# EAGLE design p2c-100 (EAGLE 9.1.0)
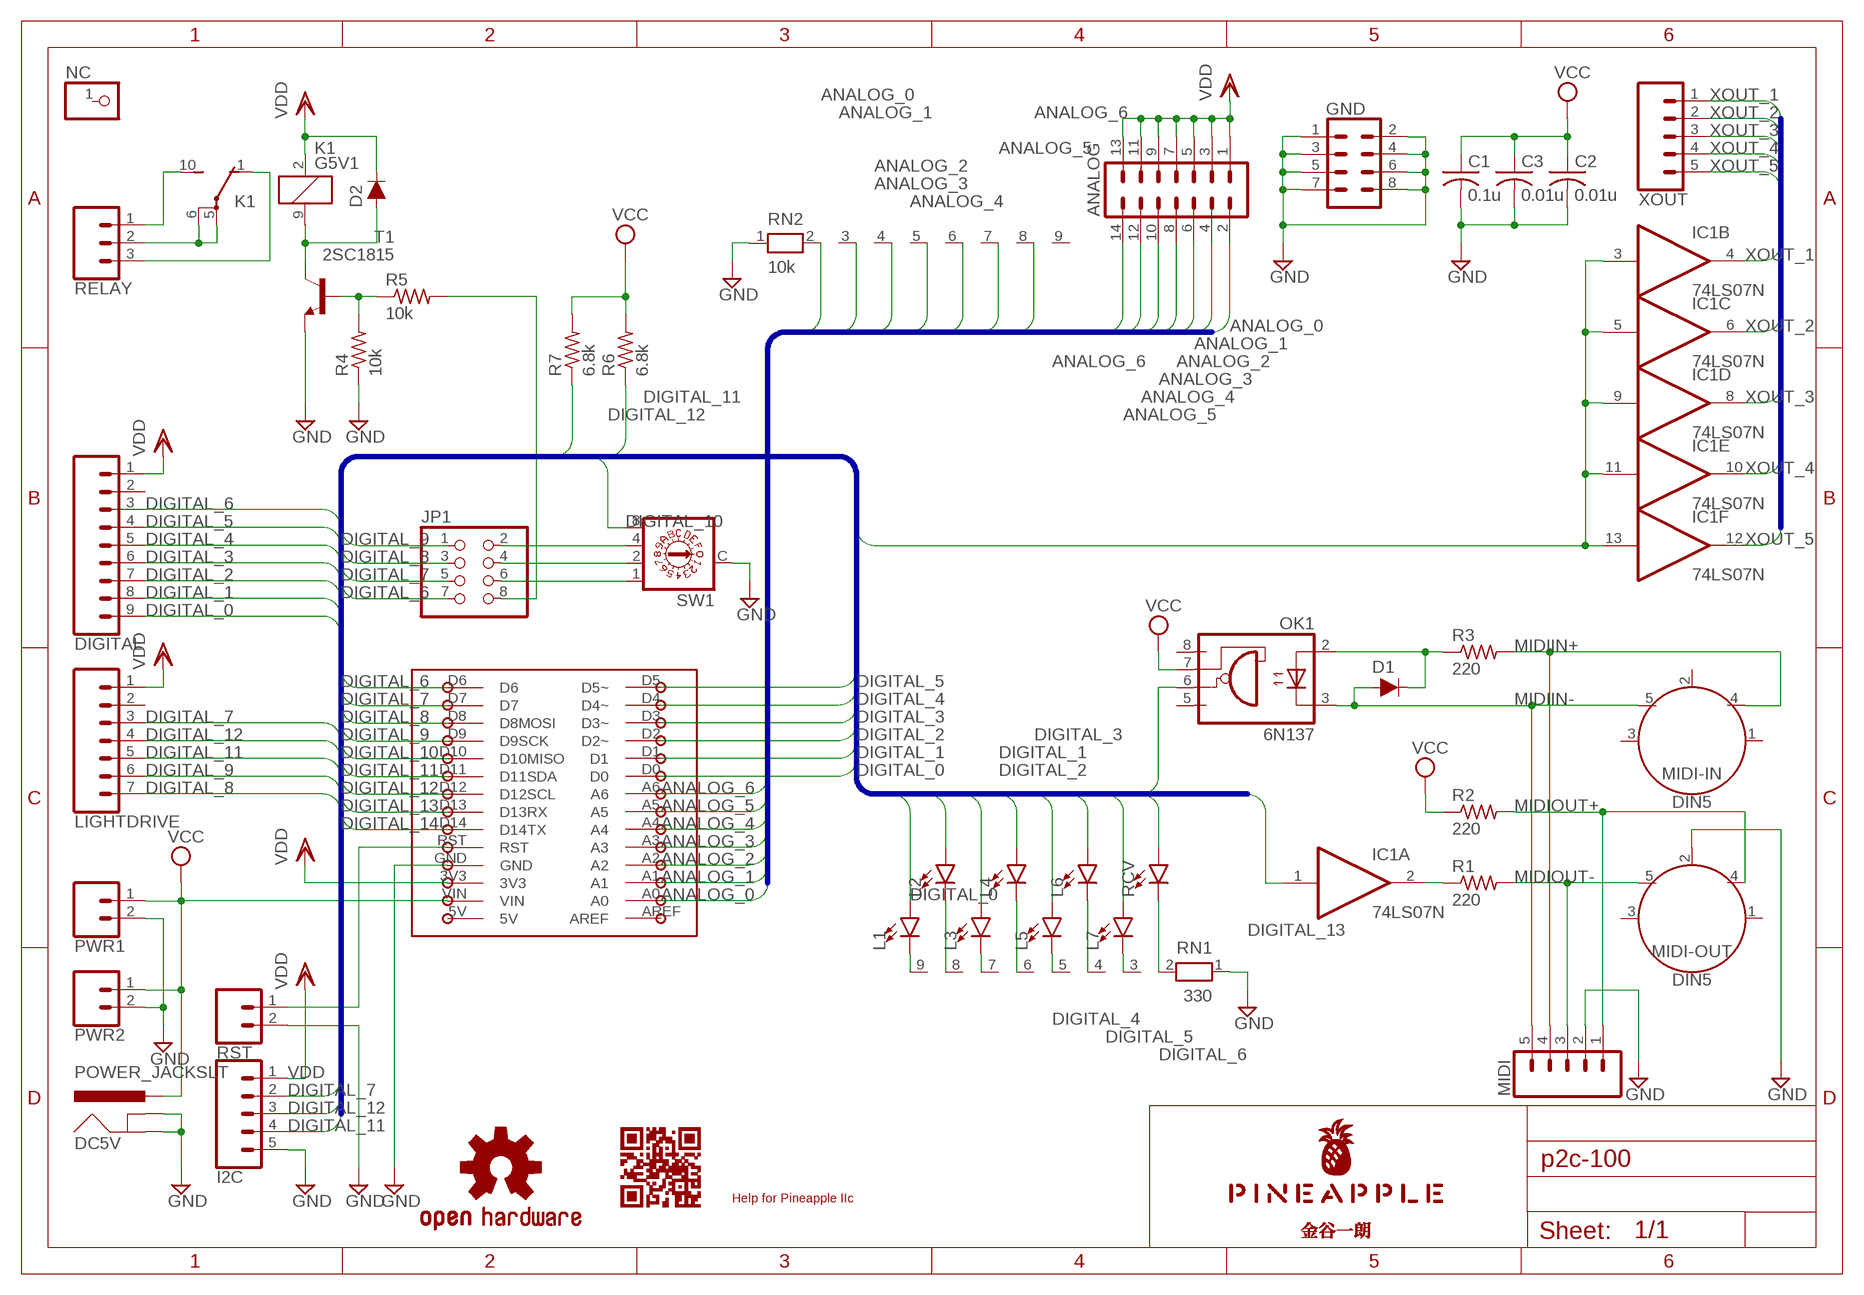
[diagram p0: schematic, sheet 1]

## Parts
ANALOG  ML14L  [ML14L]
C1  0.1u  C-US025-025X050  [C025-025X050]
C2  0.01u  C-US025-024X044  [C025-024X044]
C3  0.01u  C-US025-024X044  [C025-024X044]
D1  DIODE-1N4148  [DIODE-1N4148]
D2  DIODE-1N4148  [DIODE-1N4148]
DC5V  POWER_JACKSLT  [POWER_JACK_SLOT]
DIGITAL  CONN_09  [1X09]
GND  CONN_04X2  [2X4]
I2C  CONN_05SMD2  [1X05_1MM_RA]
IC1  74LS07N  [DIL14]
JP1  PINHD-2X4  [2X04]
K1  G5V1  [G5V1]
L1  LED-3MM-NO_SILK  [LED_3MM-NS]
L2  LED-3MM-NO_SILK  [LED_3MM-NS]
L3  LED-3MM-NO_SILK  [LED_3MM-NS]
L4  LED-3MM-NO_SILK  [LED_3MM-NS]
L5  LED-3MM-NO_SILK  [LED_3MM-NS]
L6  LED-3MM-NO_SILK  [LED_3MM-NS]
L7  LED-3MM-NO_SILK  [LED_3MM-NS]
LIGHTDRIVE  CONN_07  [1X07]
LOGO1  OSHW-LOGOS-COPPER  [OSHW-LOGO-S_COPPER]
MIDI  CONN_05JST  [JST-5-PTH]
MIDI-IN  DIN5  [DIN5-RA-PTH]
MIDI-OUT  DIN5  [DIN5-RA-PTH]
NC  PINHD-1X1  [1X01]
OK1  6N137  [DIL08]
PWR1  CONN_02  [1X02]
PWR2  CONN_02JST-PTH-2  [JST-2-PTH]
R1  220  R-US_0204/5  [0204/5]
R2  220  R-US_0204/5  [0204/5]
R3  220  R-US_0204/5  [0204/5]
R4  10k  R-US_0204/5  [0204/5]
R5  10k  R-US_0204/5  [0204/5]
R6  6.8k  R-US_0204/5  [0204/5]
R7  6.8k  R-US_0204/5  [0204/5]
RCV  LED-3MM-NO_SILK  [LED_3MM-NS]
RELAY  CONN_03JST-PTH  [JST-3-PTH]
RN1  330  RN08  [RN-9]
RN2  10k  RN08  [RN-9]
RST  CONN_02JST-PTH-2  [JST-2-PTH]
SW1  A1353HEX  [A1353HEX]
T1  2SC1815  [TO92-ECB]
U1  MKR1000  [MKR1000]
U$1  PINEAPPLE450_SILK  [PINEAPPLE450_SILK]
U$3  KANAYA768_SILK  [KANAYA768_SILK]
U$4  CARDQRCODE450_SILK  [CARDQRCODE450_SILK]
U$5  HELP_P2C  [HELP_P2C]
XOUT  CONN_05  [1X05]

## Nets
ANALOG_0: ANALOG.2 RN2.2 U1.A0
ANALOG_1: ANALOG.4 RN2.3 U1.A1
ANALOG_2: ANALOG.6 RN2.4 U1.A2
ANALOG_3: ANALOG.8 RN2.5 U1.A3
ANALOG_4: ANALOG.10 RN2.6 U1.A4
ANALOG_5: ANALOG.12 RN2.7 U1.A5
ANALOG_6: ANALOG.14 RN2.8 U1.A6
DIGITAL_0: DIGITAL.9 L1.A U1.D0
DIGITAL_1: DIGITAL.8 L2.A U1.D1
DIGITAL_2: DIGITAL.7 L3.A U1.D2(D2~)
DIGITAL_3: DIGITAL.6 L4.A U1.D3(D3~)
DIGITAL_4: DIGITAL.5 L5.A U1.D4(D4~)
DIGITAL_5: DIGITAL.4 L6.A U1.D5(D5~)
DIGITAL_6: DIGITAL.3 JP1.7 L7.A U1.D6
DIGITAL_7: I2C.2 JP1.5 LIGHTDRIVE.3 U1.D7
DIGITAL_8: JP1.3 LIGHTDRIVE.7 U1.D8(D8MOSI)
DIGITAL_9: JP1.1 LIGHTDRIVE.6 U1.D9(D9SCK)
DIGITAL_10: SW1.8 U1.D10(D10MISO)
DIGITAL_11: I2C.4 LIGHTDRIVE.5 R6.1 U1.D11(D11SDA)
DIGITAL_12: I2C.3 LIGHTDRIVE.4 R7.1 U1.D12(D12SCL)
DIGITAL_13: OK1.6(VO) RCV.A U1.D13(D13RX)
DIGITAL_14: IC1.1(A:I) IC1.3(B:I) IC1.5(C:I) IC1.9(D:I) IC1.11(E:I) IC1.13(F:I) U1.D14(D14TX)
GND [ground]: C1.2 C2.2 C3.2 DC5V.GND@1(GNDBREAK) DC5V.GND@2(GND) GND.1 GND.2 GND.3 GND.4 GND.5 GND.6 GND.7 GND.8 I2C.5 MIDI-OUT.2 MIDI.2 PWR1.2 PWR2.2 R4.1 RN1.1 RN2.1 RST.2 SW1.C T1.E U1.GND
MIDIIN+: MIDI-IN.4 MIDI.4 R3.2
MIDIIN-: D1.A MIDI-IN.5 MIDI.5 OK1.3(C)
MIDIINA: D1.C OK1.2(A) R3.1
MIDIOUT+: MIDI-OUT.4 MIDI.1 R2.2
MIDIOUT-: MIDI-OUT.5 MIDI.3 R1.2
MIDIOUTC: IC1.2(A:O) R1.1
N$1: L1.K(C) RN1.9
N$2: RST.1 U1.RST
N$3: JP1.8 R5.2
N$4: JP1.6 SW1.1
N$5: JP1.4 SW1.2
N$6: JP1.2 SW1.4
N$7: L2.K(C) RN1.8
N$8: L3.K(C) RN1.7
N$9: L4.K(C) RN1.6
N$10: L5.K(C) RN1.5
N$11: L6.K(C) RN1.4
N$12: L7.K(C) RN1.3
N$13: RCV.K(C) RN1.2
RELAYCOM: K1.5(2:P) K1.6(2:P) RELAY.2
RELAYDRIVE: R4.2 R5.1 T1.B
RELAYNC: K1.1(2:O) RELAY.3
RELAYNO: K1.10(2:S) RELAY.1
RELAYTR: D2.A K1.9 T1.C
VCC [power2]: C1.1 C2.1 C3.1 DC5V.PWR OK1.7(VE) PWR1.1 PWR2.1 R2.1 R6.2 R7.2 U1.VIN
VDD [power1]: ANALOG.1 ANALOG.3 ANALOG.5 ANALOG.7 ANALOG.9 ANALOG.11 ANALOG.13 D2.C DIGITAL.1 I2C.1 K1.2 LIGHTDRIVE.1 U1.3V3
XOUT_1: IC1.4(B:O) XOUT.1
XOUT_2: IC1.6(C:O) XOUT.2
XOUT_3: IC1.8(D:O) XOUT.3
XOUT_4: IC1.10(E:O) XOUT.4
XOUT_5: IC1.12(F:O) XOUT.5
Unconnected: DIGITAL.2 LIGHTDRIVE.2 MIDI-IN.1 MIDI-IN.2 MIDI-IN.3 MIDI-OUT.1 MIDI-OUT.3 NC.1 OK1.5(GND) OK1.8(VCC) RN2.9 U1.5V U1.AREF

## Buses
XOUT:XOUT_1,XOUT_2,XOUT_3,XOUT_4,XOUT_5
DIGITAL:DIGITAL_0,DIGITAL_1,DIGITAL_2,DIGITAL_3,DIGITAL_4,DIGITAL_5,DIGITAL_6,DIGITAL_7,DIGITAL_8,DIGITAL_9,DIGITAL_10,DIGITAL_11,DIGITAL_12,DIGITAL_13,DIGITAL_14
ANALOG:ANALOG_0,ANALOG_1,ANALOG_2,ANALOG_3,ANALOG_4,ANALOG_5,ANALOG_6

## Power pins joined to a net without a drawn wire
GND: IC1.7(P:GND)
VCC: IC1.14(P:VCC)

## Library data of the parts
ANALOG = con-ml:ML14L: HARTING; OC_FARNELL: unknown; OC_NEWARK: unknown
C1-C3 = resistor:C-US: CAPACITOR, American symbol
D1 D2 = SparkFun-DiscreteSemi:DIODE: Diode These are standard reverse protection diodes and small signal diodes. SparkFun Products: SparkFun SparkPunk Sound Kit <https://www.sparkfun.com/products/11177> SparkFun ESP8266 Thing <https://www.sparkfun.com/products/13231>; PROD_ID: DIO-08378; VALUE: 200mA/100V/1V
DC5V = SparkFun-Connectors:POWER_JACK: Power Jack Connector This is the standard 5.5mm barrel jack for power. The PTH is the most common, proven, reliable, footprint. The Slot footprint only works if the mill layer is transmitted to the PCB fab house so be warned. Here are the connectors we sell at SparkFun: DC Barrel Power Jack/Connector <https://www.sparkfun.com/products/119> (PRT-00119) DC Barrel Power Jack/Connector (SMD) <https://www.sparkfun.com/products/12748> (PRT-12748) DC Barrel Jack Adapter - Breadboard Compatible <https://www.sparkfun.com/products/10811> (PRT-10811) It is used on this SparkFun product (and many, many others): SparkFun RedBoard - Programmed with Arduino <https://www.sparkfun.com/products/12757> (DEV-12757) Also, if you need a mating power supply or connector, please check these out: Wall Adapter Power Supply - 9VDC 650mA <https://www.sparkfun.com/products/298> (TOL-00298) DC Barrel Jack Adapter - Male <https://www.sparkfun.com/products/10287> (PRT-10287); PROD_ID: PRT-00119
DIGITAL = SparkFun-Connectors:CONN_09: Multi connection point. Often used as Generic Header-pin footprint for 0.1 inch spaced/style header connections On any of the 0.1 inch spaced packages, you can populate with these: Break Away Headers - Straight <https://www.sparkfun.com/products/116> (PRT-00116) Break Away Male Headers - Right Angle <https://www.sparkfun.com/products/553> (PRT-00553) Female Headers <https://www.sparkfun.com/products/115> (PRT-00115) Break Away Headers - Machine Pin <https://www.sparkfun.com/products/117> (PRT-00117) Break Away Female Headers - Swiss Machine Pin <https://www.sparkfun.com/products/743> (PRT-00743) For SCREWTERMINALS and SPRING TERMINALS visit here: Screw Terimnals on SparkFun.com <https://www.sparkfun.com/search/results?term=Screw+Terminals> (5mm/3.5mm/2.54mm spacing) This device is also useful as a general connection point to wire up your design to another part of your project. Our various solder wires solder well into these plated through hole pads. Hook-Up Wire - Assortment (Stranded, 22 AWG) <https://www.sparkfun.com/products/11375> (PRT-11375) Hook-Up Wire - Assortment (Solid Core, 22 AWG) <https://www.sparkfun.com/products/11367> (PRT-11367) View the entire wire category on our website here <https://www.sparkfun.com/categories/141> Special notes: Molex polarized connector foot print use with SKU : PRT-08231 with associated crimp pins and housings. 1MM SMD Version SKU: PRT-10208 NOTES ON THE VARIANTS LOCK and LOCK_LONGPADS... This footprint was designed to help hold the alignment of a through-hole component (i.e. 6-pin header) while soldering it into place. You may notice that each hole has been shifted either up or down by 0.005 of an inch from it's more standard position (which is a perfectly straight line). This slight alteration caused the pins (the squares in the middle) to touch the edges of the holes. Because they are alternating, it causes a "brace" to hold the component in place. 0.005 has proven to be the perfect amount of "off-center" position when using our standard breakaway headers. Although looks a little odd when you look at the bare footprint, once you have a header in there, the alteration is very hard to notice. Also,if you push a header all the way into place, it is covered up entirely on the bottom side.
GND = SparkFun-Connectors:CONN_04X2: Multi connection point. Often used as Generic Header-pin footprint for 0.1 inch spaced/style header connections On any of the 0.1 inch spaced packages, you can populate with these: Break Away Headers - Straight <https://www.sparkfun.com/products/116> (PRT-00116) Break Away Male Headers - Right Angle <https://www.sparkfun.com/products/553> (PRT-00553) Female Headers <https://www.sparkfun.com/products/115> (PRT-00115) Break Away Headers - Machine Pin <https://www.sparkfun.com/products/117> (PRT-00117) Break Away Female Headers - Swiss Machine Pin <https://www.sparkfun.com/products/743> (PRT-00743)
I2C XOUT = SparkFun-Connectors:CONN_05: Multi connection point. Often used as Generic Header-pin footprint for 0.1 inch spaced/style header connections On any of the 0.1 inch spaced packages, you can populate with these: Break Away Headers - Straight <https://www.sparkfun.com/products/116> (PRT-00116) Break Away Male Headers - Right Angle <https://www.sparkfun.com/products/553> (PRT-00553) Female Headers <https://www.sparkfun.com/products/115> (PRT-00115) Break Away Headers - Machine Pin <https://www.sparkfun.com/products/117> (PRT-00117) Break Away Female Headers - Swiss Machine Pin <https://www.sparkfun.com/products/743> (PRT-00743) For SCREWTERMINALS and SPRING TERMINALS visit here: Screw Terimnals on SparkFun.com <https://www.sparkfun.com/search/results?term=Screw+Terminals> (5mm/3.5mm/2.54mm spacing) This device is also useful as a general connection point to wire up your design to another part of your project. Our various solder wires solder well into these plated through hole pads. Hook-Up Wire - Assortment (Stranded, 22 AWG) <https://www.sparkfun.com/products/11375> (PRT-11375) Hook-Up Wire - Assortment (Solid Core, 22 AWG) <https://www.sparkfun.com/products/11367> (PRT-11367) View the entire wire category on our website here <https://www.sparkfun.com/categories/141> Special notes: Molex polarized connector foot print use with SKU : PRT-08231 with associated crimp pins and housings. 1MM SMD Version SKU: PRT-10208
IC1 = 74xx-us:74*07: Hex BUFFER, open collector high-voltage output
JP1 = pinhead:PINHD-2X4: PIN HEADER
K1 = relay:G5V1: RELAY 1 x switch, 0.5 A/125 V AC, 1 A/24 V DC , Omron; MPN: G5V-1-DC24; OC_FARNELL: 9949593; OC_NEWARK: 36M6377
L1-L7 RCV = SparkFun-LED:LED: LED (Generic) Standard schematic elements and footprints for 5mm, 3mm, 1206, and 0603 sized LEDs. Generic LEDs with no color specified.
LIGHTDRIVE = SparkFun-Connectors:CONN_07: Multi connection point. Often used as Generic Header-pin footprint for 0.1 inch spaced/style header connections On any of the 0.1 inch spaced packages, you can populate with these: Break Away Headers - Straight <https://www.sparkfun.com/products/116> (PRT-00116) Break Away Male Headers - Right Angle <https://www.sparkfun.com/products/553> (PRT-00553) Female Headers <https://www.sparkfun.com/products/115> (PRT-00115) Break Away Headers - Machine Pin <https://www.sparkfun.com/products/117> (PRT-00117) Break Away Female Headers - Swiss Machine Pin <https://www.sparkfun.com/products/743> (PRT-00743) For SCREWTERMINALS and SPRING TERMINALS visit here: Screw Terimnals on SparkFun.com <https://www.sparkfun.com/search/results?term=Screw+Terminals> (5mm/3.5mm/2.54mm spacing) This device is also useful as a general connection point to wire up your design to another part of your project. Our various solder wires solder well into these plated through hole pads. Hook-Up Wire - Assortment (Stranded, 22 AWG) <https://www.sparkfun.com/products/11375> (PRT-11375) Hook-Up Wire - Assortment (Solid Core, 22 AWG) <https://www.sparkfun.com/products/11367> (PRT-11367) View the entire wire category on our website here <https://www.sparkfun.com/categories/141> Special notes: Molex polarized connector foot print use with SKU : PRT-08231 with associated crimp pins and housings. 1MM SMD Version SKU: PRT-10208 NOTES ON THE VARIANTS LOCK and LOCK_LONGPADS... This footprint was designed to help hold the alignment of a through-hole component (i.e. 6-pin header) while soldering it into place. You may notice that each hole has been shifted either up or down by 0.005 of an inch from it's more standard position (which is a perfectly straight line). This slight alteration caused the pins (the squares in the middle) to touch the edges of the holes. Because they are alternating, it causes a "brace" to hold the component in place. 0.005 has proven to be the perfect amount of "off-center" position when using our standard breakaway headers. Although looks a little odd when you look at the bare footprint, once you have a header in there, the alteration is very hard to notice. Also,if you push a header all the way into place, it is covered up entirely on the bottom side.
LOGO1 = SparkFun-Aesthetics:OSHW-LOGO: Open-Source Hardware (OSHW) Logo This logo indicates the piece of hardware it is found on incorporates a OSHW license and/or adheres to the definition of open source hardware found here: http://freedomdefined.org/OSHW
MIDI = SparkFun-Connectors:CONN_05: Multi connection point. Often used as Generic Header-pin footprint for 0.1 inch spaced/style header connections On any of the 0.1 inch spaced packages, you can populate with these: Break Away Headers - Straight <https://www.sparkfun.com/products/116> (PRT-00116) Break Away Male Headers - Right Angle <https://www.sparkfun.com/products/553> (PRT-00553) Female Headers <https://www.sparkfun.com/products/115> (PRT-00115) Break Away Headers - Machine Pin <https://www.sparkfun.com/products/117> (PRT-00117) Break Away Female Headers - Swiss Machine Pin <https://www.sparkfun.com/products/743> (PRT-00743) For SCREWTERMINALS and SPRING TERMINALS visit here: Screw Terimnals on SparkFun.com <https://www.sparkfun.com/search/results?term=Screw+Terminals> (5mm/3.5mm/2.54mm spacing) This device is also useful as a general connection point to wire up your design to another part of your project. Our various solder wires solder well into these plated through hole pads. Hook-Up Wire - Assortment (Stranded, 22 AWG) <https://www.sparkfun.com/products/11375> (PRT-11375) Hook-Up Wire - Assortment (Solid Core, 22 AWG) <https://www.sparkfun.com/products/11367> (PRT-11367) View the entire wire category on our website here <https://www.sparkfun.com/categories/141> Special notes: Molex polarized connector foot print use with SKU : PRT-08231 with associated crimp pins and housings. 1MM SMD Version SKU: PRT-10208; SF_ID: PRT-09917
MIDI-IN MIDI-OUT = SparkFun-Connectors:DIN5: DIN5 Connector - Female Right Angle (frequently used as a MIDI Jack connector) This type of connector and cable is frequently used for transmitting midi data (musical instrument digital interface). It is what you usually see on a keyboard or set of electronic drums. Learn more here <https://en.wikipedia.org/wiki/MIDI>. For more information on the pinout and electrical specifications of MIDI communications, please see the following resource: https://www.midi.org/specifications/item/midi-din-electrical-specification Here is the connector we sell at SparkFun: MIDI Connector - Female Right Angle <https://www.sparkfun.com/products/9536> (PRT-09536) Datasheet <hhttp://www.sparkfun.com/datasheets/Prototyping/Connectors/MIDI-RA.pdf> It is used on this SparkFun product: SparkFun MIDI Shield <https://www.sparkfun.com/products/12898> (DEV-12898); PROD_ID: CONN-09481
NC = pinhead:PINHD-1X1: PIN HEADER
OK1 = optocoupler:6N137: MOTOROLA OPTO COUPLER; MPN: 6N137; OC_FARNELL: 1328376; OC_NEWARK: 52M1895
PWR1 = SparkFun-Connectors:CONN_02: Multi connection point. Often used as Generic Header-pin footprint for 0.1 inch spaced/style header connections On any of the 0.1 inch spaced packages, you can populate with these: Break Away Headers - Straight <https://www.sparkfun.com/products/116> (PRT-00116) Break Away Male Headers - Right Angle <https://www.sparkfun.com/products/553> (PRT-00553) Female Headers <https://www.sparkfun.com/products/115> (PRT-00115) Break Away Headers - Machine Pin <https://www.sparkfun.com/products/117> (PRT-00117) Break Away Female Headers - Swiss Machine Pin <https://www.sparkfun.com/products/743> (PRT-00743) For SCREWTERMINALS and SPRING TERMINALS visit here: Screw Terimnals on SparkFun.com <https://www.sparkfun.com/search/results?term=Screw+Terminals> (5mm/3.5mm/2.54mm spacing) This device is also useful as a general connection point to wire up your design to another part of your project. Our various solder wires solder well into these plated through hole pads. Hook-Up Wire - Assortment (Stranded, 22 AWG) <https://www.sparkfun.com/products/11375> (PRT-11375) Hook-Up Wire - Assortment (Solid Core, 22 AWG) <https://www.sparkfun.com/products/11367> (PRT-11367) View the entire wire category on our website here <https://www.sparkfun.com/categories/141> Special notes: Molex polarized connector foot print use with: PRT-08233 with associated crimp pins and housings. 2.54_SCREWTERM for use with PRT-10571. 3.5mm Screw Terminal footprints for PRT-08084 5mm Screw Terminal footprints for use with PRT-08432
PWR2 RST = SparkFun-Connectors:CONN_02: Multi connection point. Often used as Generic Header-pin footprint for 0.1 inch spaced/style header connections On any of the 0.1 inch spaced packages, you can populate with these: Break Away Headers - Straight <https://www.sparkfun.com/products/116> (PRT-00116) Break Away Male Headers - Right Angle <https://www.sparkfun.com/products/553> (PRT-00553) Female Headers <https://www.sparkfun.com/products/115> (PRT-00115) Break Away Headers - Machine Pin <https://www.sparkfun.com/products/117> (PRT-00117) Break Away Female Headers - Swiss Machine Pin <https://www.sparkfun.com/products/743> (PRT-00743) For SCREWTERMINALS and SPRING TERMINALS visit here: Screw Terimnals on SparkFun.com <https://www.sparkfun.com/search/results?term=Screw+Terminals> (5mm/3.5mm/2.54mm spacing) This device is also useful as a general connection point to wire up your design to another part of your project. Our various solder wires solder well into these plated through hole pads. Hook-Up Wire - Assortment (Stranded, 22 AWG) <https://www.sparkfun.com/products/11375> (PRT-11375) Hook-Up Wire - Assortment (Solid Core, 22 AWG) <https://www.sparkfun.com/products/11367> (PRT-11367) View the entire wire category on our website here <https://www.sparkfun.com/categories/141> Special notes: Molex polarized connector foot print use with: PRT-08233 with associated crimp pins and housings. 2.54_SCREWTERM for use with PRT-10571. 3.5mm Screw Terminal footprints for PRT-08084 5mm Screw Terminal footprints for use with PRT-08432; PROD_ID: CONN-09863; SKU: PRT-09914
R1-R7 = resistor:R-US_: RESISTOR, American symbol
RELAY = SparkFun-Connectors:CONN_03: Multi connection point. Often used as Generic Header-pin footprint for 0.1 inch spaced/style header connections On any of the 0.1 inch spaced packages, you can populate with these: Break Away Headers - Straight <https://www.sparkfun.com/products/116> (PRT-00116) Break Away Male Headers - Right Angle <https://www.sparkfun.com/products/553> (PRT-00553) Female Headers <https://www.sparkfun.com/products/115> (PRT-00115) Break Away Headers - Machine Pin <https://www.sparkfun.com/products/117> (PRT-00117) Break Away Female Headers - Swiss Machine Pin <https://www.sparkfun.com/products/743> (PRT-00743) Stackable Header - 3 Pin (Female, 0.1") <https://www.sparkfun.com/products/13875> (PRT-13875) For SCREWTERMINALS and SPRING TERMINALS visit here: Screw Terimnals on SparkFun.com <https://www.sparkfun.com/search/results?term=Screw+Terminals> (5mm/3.5mm/2.54mm spacing) This device is also useful as a general connection point to wire up your design to another part of your project. Our various solder wires solder well into these plated through hole pads. Hook-Up Wire - Assortment (Stranded, 22 AWG) <https://www.sparkfun.com/products/11375> (PRT-11375) Hook-Up Wire - Assortment (Solid Core, 22 AWG) <https://www.sparkfun.com/products/11367> (PRT-11367) View the entire wire category on our website here <https://www.sparkfun.com/categories/141> Special notes: Molex polarized connector foot print use with SKU : PRT-08232 with associated crimp pins and housings.; PROD_ID: WIRE-10037; SF_ID: PRT-09915
RN1 RN2 = resistor-net:RN08: RESISTOR NETWORK; OC_FARNELL: unknown; OC_NEWARK: unknown
SW1 = switch-dil:A1353HEX: DIL/CODE SWITCH; OC_FARNELL: unknown; OC_NEWARK: unknown
T1 = transistor:2SC1815: NPN EPITAXIAL TRANSISTOR Source: TOSHIBA .. 2SC1815 1.pdf
U1 = mkr1000:MKR1000
U$1 = pineapple:PINEAPPLE450_SILK
U$3 = pineapple:KANAYA768_SILK
U$4 = pineapple:CARDQRCODE450_SILK
U$5 = pineapple:HELP_P2C

## Net classes
0 default: width 0.152 mm, drill 0.305 mm, clearance 0.152 mm
1 ground: width 0.152 mm, drill 0.305 mm, clearance 0.152 mm
2 power1: width 0.305 mm, drill 0.305 mm, clearance 0.152 mm
3 power2: width 0.61 mm, drill 0.305 mm, clearance 0.152 mm

## Board
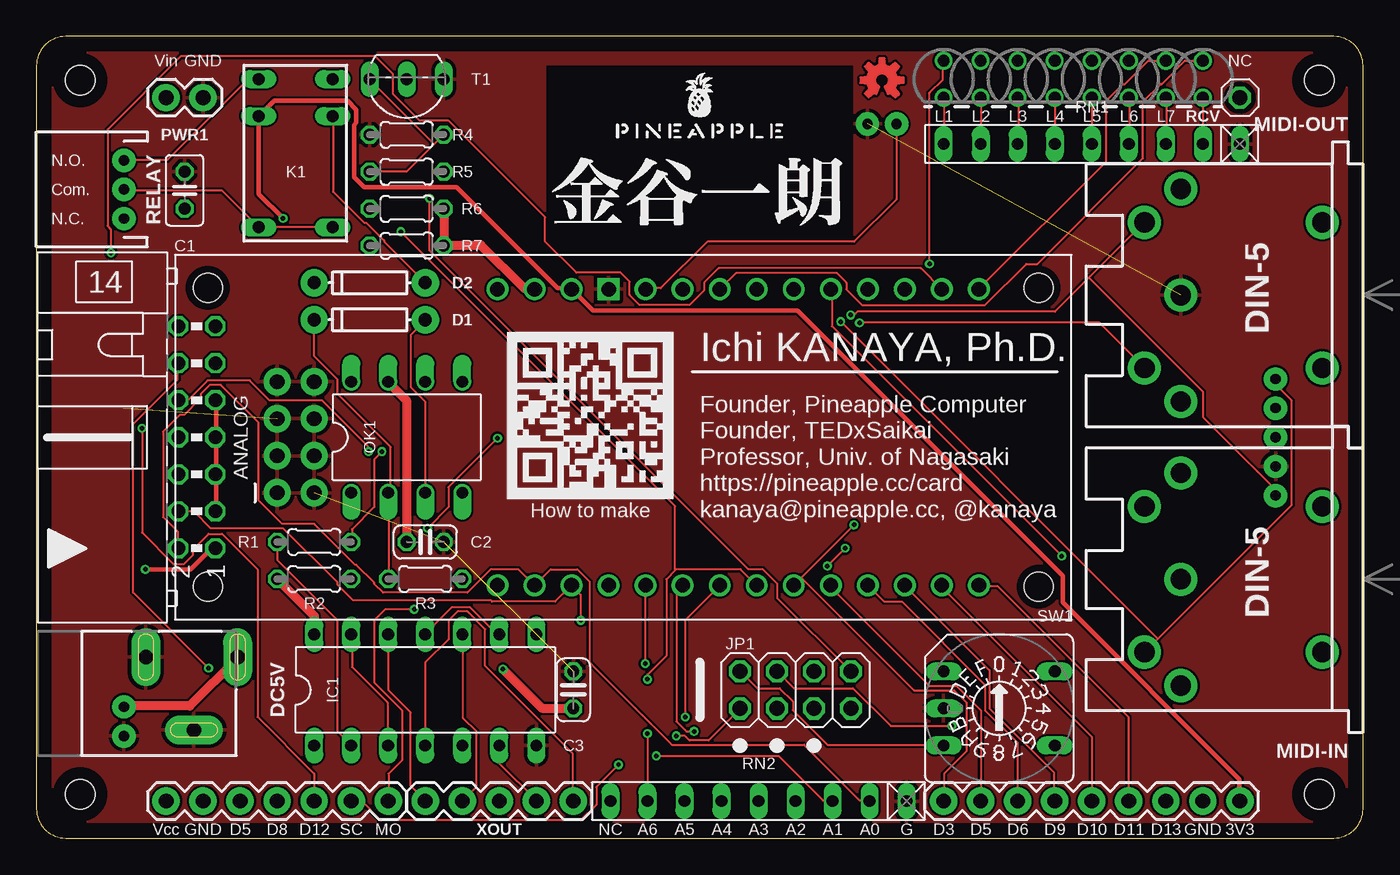
[diagram p1: board, top side]
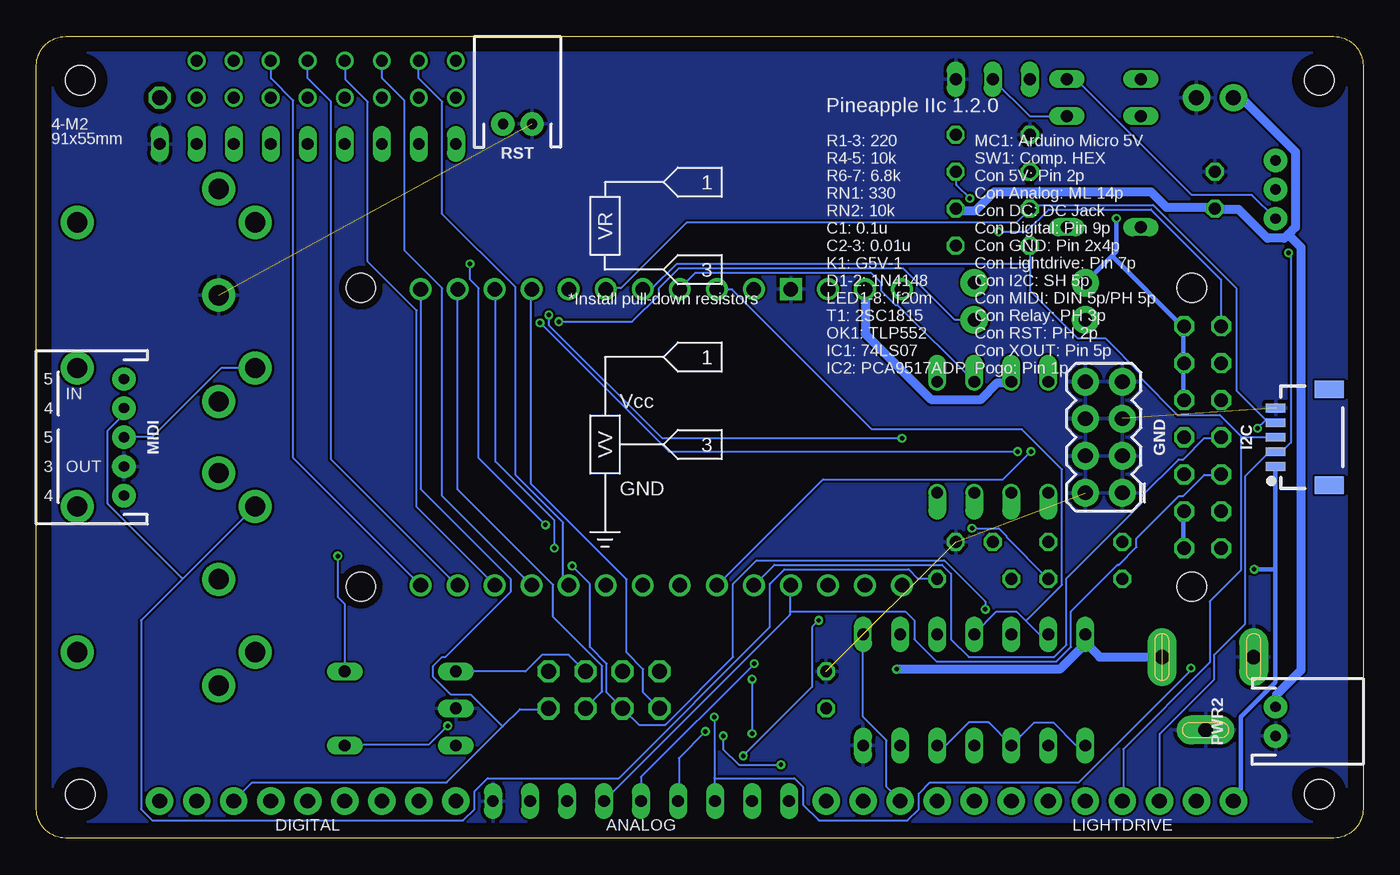
[diagram p2: board, bottom side, seen from below]

Size 91 x 55 mm. Coordinates in mm from the lower left corner, seen from the top.
Outline: 0,53 0,2 arc90 2,0 89,0 arc90 91,2 91,53 arc90 89,55 2,55 arc90 0,53
Copper layers (1*16): Top 0.035mm / dielectric 1.53mm / Bottom 0.035mm
Design rules "pban_5mil-l2": minimum track width 5mil, minimum drill 0.3mm, track to track 5mil, track to pad 0.229mm, pad to pad 5mil, via to via 5mil, smd to smd 5mil, copper to edge 0.5mm, drill to drill 0.5mm, minimum pad ring 0.15mm, minimum via ring 0.15mm, stop-mask expansion 4mil, vias tented up to drill 0.35mm, thermal gap 10mil
Holes 2 mm at 3,3 3,52 88,52 88,3
tRestrict: area 0,0 to 91,1; area 90,0 to 91,55; area 0,54 to 91,55; area 0,0 to 1,55; area 1.2,50.2 to 4.8,53.8; area 1.2,1.2 to 4.8,4.8; area 86.2,1.2 to 89.8,4.8; area 86.2,50.2 to 89.8,53.8; area 81.5,49.8 to 83.5,51.8; area 35,41 to 56,53
bRestrict: area 0,0 to 91,1; area 90,0 to 91,55; area 0,54 to 91,55; area 0,0 to 1,55; area 86.2,50.2 to 89.8,53.8; area 86.2,1.2 to 89.8,4.8; area 1.2,50.2 to 4.8,53.8; area 1.2,1.2 to 4.8,4.8; area 81.5,49.8 to 83.5,51.8
vRestrict: area 32,22 to 70,35

### Footprints (pad centres in the part's own frame; a part is rotated, then mirrored left to right if it is on the bottom)
ML14L = drill 0.914 octagon: 1 -7.62,-1.27; 2 -7.62,1.27; 3 -5.08,-1.27; 4 -5.08,1.27; 5 -2.54,-1.27; 6 -2.54,1.27; 7 0,-1.27; 8 0,1.27; 9 2.54,-1.27; 10 2.54,1.27; 11 5.08,-1.27; 12 5.08,1.27; 13 7.62,-1.27; 14 7.62,1.27
C025-025X050 = drill 0.813 octagon: 1 -1.27,0; 2 1.27,0
C025-024X044 = drill 0.813 octagon: 1 -1.27,0; 2 1.27,0
DIODE-1N4148 = drill 0.9 pad 1.88: A -3.81,0; C 3.81,0
POWER_JACK_SLOT = drill 1 pad 2 long: GND@1 2.58,7.5; GND@2 7.58,10.8; PWR 2.58,13.8
1X09 = drill 1.016 pad 1.88: 1 0,0; 2 2.54,0; 3 5.08,0; 4 7.62,0; 5 10.16,0; 6 12.7,0; 7 15.24,0; 8 17.78,0; 9 20.32,0
2X4 = drill 1.016 pad 1.88: 1 -3.81,-1.27; 2 -3.81,1.27; 3 -1.27,-1.27; 4 -1.27,1.27; 5 1.27,-1.27; 6 1.27,1.27; 7 3.81,-1.27; 8 3.81,1.27
1X05_1MM_RA = smd 0.6 x 1.35: 1 -2,0; 2 -1,0; 3 0,0; 4 1,0; 5 2,0 | smd 1.2 x 2: NC1 3.3,-3.675; NC2 -3.3,-3.675
DIL14 = drill 0.813 long: 1 -7.62,-3.81; 2 -5.08,-3.81; 3 -2.54,-3.81; 4 0,-3.81; 5 2.54,-3.81; 6 5.08,-3.81; 7 7.62,-3.81; 8 7.62,3.81; 9 5.08,3.81; 10 2.54,3.81; 11 0,3.81; 12 -2.54,3.81; 13 -5.08,3.81; 14 -7.62,3.81
2X04 = drill 1.016 octagon: 1 -3.81,-1.27; 2 -3.81,1.27; 3 -1.27,-1.27; 4 -1.27,1.27; 5 1.27,-1.27; 6 1.27,1.27; 7 3.81,-1.27; 8 3.81,1.27
G5V1 = drill 0.813 long: 1 -5.08,-2.54; 2 -2.54,-2.54; 5 5.08,-2.54; 6 5.08,2.54; 9 -2.54,2.54; 10 -5.08,2.54
LED_3MM-NS = drill 0.813: A -1.27,0; K 1.27,0
1X07 = drill 1.016 pad 1.88: 1 0,0; 2 2.54,0; 3 5.08,0; 4 7.62,0; 5 10.16,0; 6 12.7,0; 7 15.24,0
JST-5-PTH = drill 0.7 pad 1.6: 1 -4,0; 2 -2,0; 3 0,0; 4 2,0; 5 4,0
DIN5-RA-PTH = drill 1.4 pad 2.286: 1 7.3,12.5; 2 0,12.5; 3 -7.3,12.5; 4 5,15; 5 -5,15; 6 -5,2.8; 7 5,2.8
1X01 = drill 1.016 octagon: 1 0,0
DIL08 = drill 0.813 offset: 1 -3.81,-3.81; 2 -1.27,-3.81; 3 1.27,-3.81; 4 3.81,-3.81; 5 3.81,3.81; 6 1.27,3.81; 7 -1.27,3.81; 8 -3.81,3.81
1X02 = drill 1.016 pad 1.88: 1 0,0; 2 2.54,0
JST-2-PTH = drill 0.7 pad 1.6: 1 -1,0; 2 1,0
0204/5 = drill 0.813 octagon: 1 -2.54,0; 2 2.54,0
JST-3-PTH = drill 0.7 pad 1.6: 1 -2,0; 2 0,0; 3 2,0
RN-9 = drill 0.813 long: 1 -10.16,0; 2 -7.62,0; 3 -5.08,0; 4 -2.54,0; 5 0,0; 6 2.54,0; 7 5.08,0; 8 7.62,0; 9 10.16,0
A1353HEX = drill 0.813 long: 1 3.81,-2.54; 2 -3.81,2.54; 4 3.81,2.54; 8 -3.81,-2.54; C 3.81,0
TO92-ECB = drill 0.813 long: B 2.54,0; C 0,0; E -2.54,0
MKR1000 = drill 1: 3V3 22.66,34.292; 5V 22.66,39.372; A0 2.34,36.832; A1 2.34,34.292; A2 2.34,31.752; A3 2.34,29.212; A4 2.34,26.672; A5 2.34,24.132; A6 2.34,21.592; AREF 2.34,39.372; D0 2.34,19.052; D1 2.34,16.512; D2 2.34,13.972; D3 2.34,11.432; D4 2.34,8.892; D5 2.34,6.352; D6 22.66,6.352; D7 22.66,8.892; D8 22.66,11.432; D9 22.66,13.972; D10 22.66,16.512; D11 22.66,19.052; D12 22.66,21.592; D13 22.66,24.132; D14 22.66,26.672; RST 22.66,29.212; VIN 22.66,36.832 | drill 1 square: GND 22.66,31.752 | hole 2: 2.25,2.25; 22.75,2.25; 2.25,59.25; 22.75,59.25
1X05 = drill 1.016 pad 1.88: 1 0,0; 2 2.54,0; 3 5.08,0; 4 7.62,0; 5 10.16,0

### Placement (x,y rotation side)
ANALOG  11,27.5 90 top
C1  10.16,44.45 90 top
C2  26.67,20.32 0 top
C3  36.83,10.16 90 top
D1  22.86,35.56 180 top
D2  22.86,38.1 180 top
DC5V  0,15 270 top
DIGITAL  82.55,2.54 180 top
GND  17.78,27.5 90 bottom
I2C  6,27.5 90 bottom
IC1  26.67,10.16 0 top
JP1  52.07,10.16 0 top
K1  17.78,46.99 270 top
L1  62.23,52.07 270 top
L2  64.77,52.07 270 top
L3  67.31,52.07 270 top
L4  69.85,52.07 270 top
L5  72.39,52.07 270 top
L6  74.93,52.07 270 top
L7  77.47,52.07 270 top
LIGHTDRIVE  8.89,2.54 0 top
LOGO1  58,52 0 top
MIDI  85,27.5 90 bottom
MIDI-IN  91,17.75 90 top
MIDI-OUT  91,37.25 90 top
NC  82.55,50.8 0 top
OK1  25.4,27.5 0 top
PWR1  8.89,50.8 0 top
PWR2  6,8 270 bottom
R1  19.05,20.32 0 top
R2  19.05,17.78 0 top
R3  26.67,17.78 0 top
R4  25.4,48.26 0 top
R5  25.4,45.72 0 top
R6  25.4,43.18 0 top
R7  25.4,40.64 0 top
RCV  80.01,52.07 270 top
RELAY  6,44.5 90 top
RN1  72.39,47.62 180 top
RN2  49.53,2.54 180 top
RST  58,49 0 bottom
SW1  66.04,8.89 180 top
T1  25.4,52.07 180 top
U1  71,15 90 top
U$1  45.5,48 0 top
U$3  45.5,42 0 top
U$4  38,29 0 top
U$5  48,36 0 bottom
XOUT  36.83,2.54 180 top

### Tracks (layer width: path | path; a pad name or v marks a point on that pad's centre or on a via)
ANALOG_0
  Top 0.152: RN2.2 57.15,2.59 56.46,2.59 52.65,6.4 43.59,6.4 37.95,12.04 37.95,17.6 37.11,18.44 35.28,18.44 34.21,17.37 U1.A0 34.14,17.37 33.07,18.44 31.17,18.44 29.57,16.84 23.77,16.84 23.16,17.45 23.16,17.53 21.95,18.75 21.87,18.75 19.05,21.57 16.84,21.57 15.24,23.16 15.24,28.5 12.65,31.09 11.89,31.09 11.28,30.48 11.28,30.18 10.13,29.03 9.83,29.03 8.69,27.89 8.69,22.02 9.68,21.03 9.68,19.89 ANALOG.2
ANALOG_1  (via drill 0.3)
  Top 0.152: v42.52,5.64 50.9,5.64 53.95,2.59 54.56,2.59 RN2.3 | v37.34,14.94 37.34,16.69 36.73,17.3 U1.A1 36.65,17.3 35.59,16.23 31.24,16.23 31.17,16.31 21.72,16.31 20.65,17.37 20.65,17.53 16.92,21.26 11.96,21.26 10.82,22.4 9.75,22.4 ANALOG.4
  Bottom 0.152: v42.52,5.64 37.8,10.36 37.8,14.48 v37.34,14.94
ANALOG_2
  Bottom 0.152: 39.32,15.54 39.32,17.3 U1.A2 | 39.32,15.54 39.32,15.32 52.05,2.59 RN2.4 | 39.32,15.54 31.39,15.54 30.79,14.94 30.79,13.64 29.26,12.12 21.03,12.12 20.04,13.11 20.04,15.54 16.84,18.75 16.76,18.75 15.54,19.96 15.54,20.57 12.65,23.47 12.34,23.47 10.9,24.92 9.75,24.92 ANALOG.6
ANALOG_3  (via drill 0.3)
  Top 0.152: v41.76,11.96 41.76,17.3 U1.A3
  Bottom 0.152: v41.76,11.96 49.53,4.19 49.53,2.59 RN2.5 | ANALOG.8 9.75,27.43 10.9,27.43 12.34,25.98 12.65,25.98 15.24,23.39 15.24,22.94 20.34,17.83 20.34,13.26 21.18,12.42 27.05,12.42 28.27,13.64 28.27,18.14 28.88,18.75 40.39,18.75 41.76,17.37 U1.A3
ANALOG_4  (via drill 0.3)
  Top 0.152: v45.11,7.32 44.58,7.32 43.89,8 43.89,16.92 44.27,17.3 U1.A4 | v22.78,26.52 22.78,26.82 19.58,30.02 16,30.02 14.63,31.39 11.73,31.39 10.44,30.1 9.75,30.1 ANALOG.10
  Bottom 0.152: v45.11,7.32 46.94,5.49 46.94,2.59 RN2.6 | v22.78,26.52 24.69,24.61 37.03,24.61 44.27,17.37 U1.A4
ANALOG_5  (via drill 0.3)
  Top 0.152: v44.5,8.31 44.5,14.94 46.86,17.3 U1.A5 | v11.81,11.66 6.63,16.84 6.63,28.42 9.68,31.47 9.68,32.54 ANALOG.12
  Bottom 0.152: v44.5,8.31 44.5,4.12 | 44.5,4.12 44.5,2.59 RN2.7 | v11.81,11.66 11.81,11.51 19.51,3.81 29.72,3.81 30.48,3.05 30.48,1.98 31.24,1.22 37.34,1.22 38.41,2.29 38.41,3.5 39.01,4.12 44.5,4.12
ANALOG_6  (via drill 0.3)
  Top 0.152: v41.91,7.16 41.91,2.59 RN2.8 | v41.91,10.9 41.91,11.2 43.2,12.5 43.2,17.75 43.85,18.4 | 43.85,18.4 43.89,18.44 48.31,18.44 49.38,17.37 U1.A6 | v24.99,41.6 43.81,22.78 43.81,18.44 43.85,18.4
  Bottom 0.152: v41.91,10.9 v41.91,7.16 | v24.99,41.6 23.09,41.6 21.57,43.13 14.55,43.13 9.75,38.33 9.75,35.13 ANALOG.14
DIGITAL_0  (via drill 0.3)
  Top 0.152: v61.27,39.4 61.27,51.13 62.18,52.05 62.18,53.34 L1.A | v56.08,21.49 51.97,17.37 U1.D0 52.5,17.83 60.2,10.13 62.94,10.13 63.78,9.3 63.78,5.94 62.26,4.42 62.26,2.59 DIGITAL.9
  Bottom 0.152: v61.27,39.4 61.27,38.33 60.66,37.72 60.66,26.06 v56.08,21.49
DIGITAL_1
  Top 0.152: DIGITAL.8 64.77,2.59 64.77,8.76 63.09,10.44 61.27,10.44 54.56,17.14 54.56,17.3 U1.D1
  Bottom 0.152: L2.A 64.77,52.12 63.17,50.52 63.17,42.82 58.14,37.8 58.14,24.92 54.86,21.64 54.86,17.68 54.56,17.37 U1.D1
DIGITAL_2
  Top 0.152: DIGITAL.7 67.28,2.59 67.28,6.55 65.08,8.76 65.08,10.52 59.36,16.23 58.14,16.23 57.07,17.3 U1.D2
  Bottom 0.152: L3.A 67.28,53.34 67.28,52.12 65.76,50.6 65.76,40.31 63.17,37.72 63.17,23.47 57.07,17.37 U1.D2
DIGITAL_3
  Top 0.152: DIGITAL.6 69.8,2.59 69.8,4.5 65.38,8.91 65.38,11.51 59.59,17.3 U1.D3
  Bottom 0.152: L4.A 69.8,53.34 69.8,52.05 68.28,50.52 68.28,39.55 64.92,36.2 64.92,22.71 59.59,17.37 U1.D3
DIGITAL_4
  Top 0.152: DIGITAL.5 72.39,2.59 72.39,6.93 62.18,17.14 62.18,17.3 U1.D4
  Bottom 0.152: L5.A 72.39,52.12 70.79,50.52 70.79,25.98 62.18,17.37 U1.D4
DIGITAL_5
  Top 0.152: DIGITAL.4 74.91,2.59 74.91,8.31 65.91,17.3 64.69,17.3 U1.D5
  Bottom 0.152: L6.A 74.91,53.34 74.91,52.12 73.38,50.6 73.38,26.06 64.69,17.37 U1.D5
DIGITAL_6
  Top 0.152: L7.A 77.42,53.34 76.28,53.34 74.68,51.74 74.52,51.74 73.38,50.6 73.38,46.41 64.69,37.72 U1.D6
  Bottom 0.152: 59.02,7.66 62.87,3.81 76.2,3.81 77.42,2.59 DIGITAL.3 | 59.02,7.66 57.84,8.84 55.93,8.84 JP1.7 | U1.D6 64.62,37.64 64.62,23.93 58.45,17.75 58.45,16.92 62.94,12.42 63.17,12.42 63.78,11.81 63.78,11.05 62.56,9.83 61.19,9.83 59.05,7.7 59.02,7.66
DIGITAL_7  (via drill 0.3)
  Top 0.152: v5.11,40.16 5.11,41.76 4.88,41.99 4.88,48.62 9.91,53.65 23.24,53.65 24.46,52.43 24.46,51.05 26.29,49.23 28.27,49.23 34.9,42.6 34.9,40.92 37.03,38.79 40.08,38.79 40.69,38.18 40.69,37.26 41.38,36.58 44.81,36.58 45.8,37.57 45.8,38.1 46.79,39.09 60.66,39.09 62.1,37.64 U1.D7
  Bottom 0.152: LIGHTDRIVE.3 13.95,2.59 13.95,7.16 10.21,10.9 10.21,12.57 8.08,14.71 8.08,24.84 6.48,26.44 6.02,26.44 I2C.2 5.94,26.52 5.56,26.52 4.95,27.13 4.95,40.01 v5.11,40.16 | U1.D7 62.1,37.64 62.1,23.93 55.55,17.37 55.55,15.16 52.2,11.81 52.2,10.06 53.34,8.91 JP1.5
DIGITAL_8  (via drill 0.3)
  Top 0.152: v54.25,18.67 v55.47,19.89 | v25.91,15.7 23.93,15.7 23.16,14.94 23.16,10.67 25.07,8.76 25.07,5.33 24.16,4.42 24.16,2.59 LIGHTDRIVE.7
  Bottom 0.152: v55.47,19.89 55.47,21.79 59.51,25.83 59.51,37.64 U1.D8 | v54.25,18.67 53.03,17.45 53.03,13.11 51.89,11.96 51.89,9.98 50.83,8.91 JP1.3 50.75,8.84 49.68,7.77 47.85,7.77 43.2,12.42 43.2,17.45 41.6,19.05 28.73,19.05 25.91,16.23 v25.91,15.7
DIGITAL_9  (via drill 0.3)
  Top 0.152: v39.93,5.03 38.41,3.5 38.41,2.29 37.34,1.22 23.62,1.22 22.33,2.52 21.64,2.52 LIGHTDRIVE.6 | v43.89,7.01 44.5,7.01 44.81,6.71 46.1,6.71 48.23,8.84 JP1.1
  Bottom 0.152: U1.D9 57.07,37.64 57.07,24.31 50.52,17.75 50.52,12.72 49.38,11.58 49.38,9.98 48.31,8.91 JP1.1 | v39.93,5.03 42.82,5.03 43.89,6.1 v43.89,7.01
DIGITAL_10  (via drill 0.3)
  Top 0.152: v70.33,19.36 54.56,35.13 54.56,37.64 U1.D10
  Bottom 0.152: v70.33,19.36 70.33,16.54 69.88,16.08 69.88,11.43 SW1.8
DIGITAL_11  (via drill 0.3)
  Top 0.152: v7.24,28.12 7.24,20.95 9.37,18.82 10.13,18.82 10.74,19.43 10.74,19.81 11.81,20.88 12.72,20.88 15.16,18.44 15.16,8.31 19.05,4.42 19.05,2.59 LIGHTDRIVE.5
  Bottom 0.152: 6.67,28.69 8.69,30.71 8.69,37.72 14.4,43.43 22.63,43.43 22.86,43.2 R6.1 22.86,43.13 23.77,42.22 46.41,42.22 50.9,37.72 51.89,37.72 U1.D11 | 6.67,28.69 6.55,28.57 6.02,28.57 I2C.4 | v7.24,28.12 6.71,28.65 6.67,28.69
DIGITAL_12
  Bottom 0.152: 8.34,27.55 9.83,29.03 12.72,29.03 15.24,31.55 15.24,31.85 17.68,34.29 19.58,34.29 22.86,37.57 22.86,39.4 | 8.34,27.55 8.31,27.51 6.02,27.51 I2C.3 | 22.86,39.4 22.86,40.62 R7.1 | 22.86,39.4 47.09,39.4 48.77,37.72 49.38,37.72 U1.D12 | LIGHTDRIVE.4 16.46,2.59 16.46,6.1 10.52,12.04 10.52,16.23 8.38,18.36 8.38,27.51 8.34,27.55
DIGITAL_13
  Top 0.152: RCV.A 78.79,53.34 77.19,51.74 77.11,51.74 75.89,50.52 75.89,46.63 68.66,39.4 67.89,39.4 65.08,36.58 56.62,36.58 55.55,37.64 55.55,38.1 54.86,38.79 48.01,38.79 46.94,37.72 U1.D13
  Bottom 0.152: OK1.6 31.93,36.58 32.08,36.58 33.07,37.57 33.07,38.1 33.76,38.79 45.8,38.79 46.86,37.72 U1.D13
DIGITAL_14
  Top 0.152: IC1.9 31.7,14.02 31.55,14.02 29.72,15.85 28.5,15.85 26.67,14.02 IC1.11 | IC1.3 24.08,6.4 24.08,9.3 21.64,11.73 21.64,13.95 IC1.13
  Bottom 0.152: IC1.1 19.05,6.4 19.74,6.4 21.26,7.92 22.55,7.92 24.08,6.4 IC1.3 24.16,6.4 25.68,7.92 27.05,7.92 28.57,6.4 29.18,6.4 IC1.5 | 23.13,14.9 23.77,15.54 25.15,15.54 26.67,14.02 IC1.11 | 23.13,14.9 22.25,14.02 21.64,14.02 IC1.13 | U1.D14 44.27,37.64 43.28,37.64 33.68,28.04 23.39,28.04 20.65,25.3 20.65,17.37 23.09,14.94 23.13,14.9
GND  (4 unrouted)
  pour Bottom: -1,-1 92,-1 92,56 -1,56
  pour Top: -2,-2 93,-2 93,57 -2,57
MIDIIN+
  Bottom 0.152: 80.96,17.79 76.05,22.71 MIDI-IN.4 | 80.96,17.79 83.82,14.94 83.82,1.98 83.06,1.22 61.72,1.22 60.96,1.98 60.96,3.2 60.05,4.12 51.05,4.12 40.69,14.48 40.69,17.45 39.7,18.44 31.17,18.44 30.56,17.83 29.26,17.83 R3.2 | MIDI.4 85.04,29.49 85.04,29.03 86.11,27.96 86.11,22.94 81,17.83 80.96,17.79
MIDIIN-  (via drill 0.3)
  Top 0.152: OK1.3 26.67,29.95 25.68,30.94 25.68,34.52 26.67,35.51 D1.A | 76.92,13.68 76.05,12.8 MIDI-IN.5 | 76.92,13.68 86.11,22.86 86.11,30.02 85.04,31.09 85.04,31.47 MIDI.5 | v55.17,35.43 76.89,13.72 76.92,13.68
  Bottom 0.152: v55.17,35.43 50.14,35.43 48.31,37.26 48.31,37.72 46.94,39.09 31.55,39.09 28.04,35.59 26.67,35.59 D1.A
MIDIINA
  Top 0.152: R3.1 24.16,17.83 24.16,23.62 OK1.2 24.16,23.7 24.31,23.85 24.31,26.82 20.65,30.48 20.65,31.47 19.05,33.07 19.05,35.51 D1.C
MIDIOUT+  (via drill 0.3)
  Top 0.152: v26.82,21.26 28.27,22.71 28.27,24.08 v31.62,27.43 | v55.85,35.89 56.08,35.89 56.31,36.12 69.88,36.12 72.2,38.44 | 72.2,38.44 75.97,42.22 MIDI-OUT.4 | MIDI.1 84.96,23.55 84.96,23.93 80.01,28.88 80.01,30.63 72.24,38.41 72.2,38.44
  Bottom 0.152: v26.82,21.26 24.99,21.26 24.46,20.73 24.46,20.65 21.64,17.83 R2.2 | v31.62,27.43 48.08,27.43 55.85,35.2 v55.85,35.89
MIDIOUT-  (via drill 0.3)
  Top 0.152: v23.7,26.52 23.16,25.98 23.16,22.71 21.64,21.18 21.64,20.34 R1.2 | v56.46,35.36 72.92,35.36 75.97,32.31 MIDI-OUT.5
  Bottom 0.152: v23.7,26.52 47.62,26.52 v56.46,35.36 | MIDI.3 84.96,27.51 83.06,27.51 78.33,32.23 76.05,32.23 MIDI-OUT.5
MIDIOUTC
  Top 0.152: R1.1 16.54,20.27 16.54,19.05 20.65,14.94 20.65,7.32 21.57,6.4 IC1.2
N$1
  Top 0.152: RN1.9 62.26,47.62 62.26,50.75 L1.K
N$2
  Top 0.152: U1.RST 41.83,37.72 42.82,37.72 46.02,40.92 56.08,40.92 58.98,43.81 58.98,49 RST.1
N$3  (via drill 0.3)
  Top 0.152: v26.98,43.89 26.98,40.31 48.84,18.44 49.84,18.44 50.83,17.45 50.83,16.46 55.85,11.43 JP1.8
  Bottom 0.152: v26.98,43.89 27.89,44.81 27.89,45.72 R5.2
N$4
  Bottom 0.152: JP1.6 54.48,12.57 56.31,12.57 57.45,11.43 62.18,11.43 SW1.1
N$5  (via drill 0.3)
  Top 0.152: v62.79,7.7 58.6,7.7 56.01,10.29 51.97,10.29 50.83,11.43 JP1.4
  Bottom 0.152: v62.79,7.7 64.08,6.4 69.8,6.4 SW1.2
N$6
  Top 0.152: SW1.4 62.18,6.4 54.25,6.4 51.89,8.76 51.89,9.37 50.98,10.29 49.45,10.29 48.31,11.43 JP1.2
N$7
  Top 0.152: RN1.8 64.77,50.75 L2.K
N$8
  Top 0.152: RN1.7 67.36,47.62 67.36,50.75 L3.K
N$9
  Top 0.152: RN1.6 69.88,47.62 69.88,50.75 L4.K
N$10
  Top 0.152: RN1.5 72.39,50.75 L5.K
N$11
  Top 0.152: RN1.4 74.98,47.62 74.98,50.75 L6.K
N$12
  Top 0.152: RN1.3 77.5,47.62 77.5,50.75 L7.K
N$13
  Top 0.152: RN1.2 80.01,50.75 RCV.K
RELAYCOM
  Top 0.152: K1.6 20.27,41.91 K1.5 12.72,44.42 6.02,44.42 RELAY.2
RELAYDRIVE
  Top 0.152: R5.1 25.38,45.72 27.28,47.62 | 27.28,47.62 27.89,48.23 R4.2 | 27.28,47.62 22.86,52.05 T1.B
RELAYNC
  Top 0.152: K1.1 15.24,52.05 14.48,52.05 8.99,46.56 6.02,46.56 RELAY.3
RELAYNO
  Bottom 0.152: K1.10 20.27,52.05 19.66,52.05 11.73,44.12 7.62,44.12 6.02,42.52 RELAY.1
RELAYTR
  Top 0.152: D2.A 23.85,40.92 23.85,41 22.63,42.22 22.48,42.22 20.34,44.35 20.34,49.53 K1.9
  Bottom 0.152: K1.9 20.34,49.53 22.86,49.53 25.38,52.05 T1.C
VCC  (via drill 0.3)
  Top 0.61: PWR2.1 6.02,9.07 10.52,9.07 13.79,12.34 DC5V.PWR | IC1.14 19.05,14.02 19.05,15.24 16.54,17.75 R2.1 | v32,11.58 34.67,8.91 36.8,8.91 C3.1 | C2.1 25.38,20.34 25.38,30.02 24.16,31.24 OK1.7 | R6.2 27.96,43.13 27.96,40.69 R7.2 28.27,40.69 30.48,40.69 33.45,37.72 34.14,37.72 U1.VIN
  Bottom 0.61: v32,11.58 20.8,11.58 19.05,13.34 19.05,13.95 IC1.14 18.82,13.18 18.06,12.42 13.87,12.42 DC5V.PWR | 5.14,41.41 4.65,41.91 4.65,47.09 8.31,50.75 8.84,50.75 PWR1.1 | 5.14,41.41 5.41,41.15 6.55,41.15 8.53,43.13 10.13,43.13 C1.1 10.44,43.28 13.49,43.28 14.55,44.35 25.3,44.35 26.59,43.05 27.81,43.05 27.89,43.13 R6.2 | OK1.7 24.16,31.24 25.07,31.24 26.21,30.1 29.64,30.1 34.14,34.59 34.14,37.64 U1.VIN | PWR2.1 5.94,9.07 5.94,9.83 4.27,11.51 4.27,40.54 4.95,41.22 5.14,41.41
VDD  (via drill 0.3)
  Top 0.305: ANALOG.3 12.34,22.48 12.34,24.84 ANALOG.5 12.34,24.99 12.34,27.43 ANALOG.7 12.34,27.58 12.34,30.02 ANALOG.9 | v16.92,42.52 15.24,44.2 K1.2 15.32,49.61 16.31,50.6 21.34,50.6 21.95,49.99 21.95,49.07 21.79,48.92 21.79,45.34 22.48,44.65 28.8,44.65 35.74,37.72 36.65,37.72 U1.3V3 36.8,37.57 38.18,36.2 52.2,36.2 70.41,17.98 70.41,16.15 82.53,4.04 82.53,2.59 DIGITAL.1 | v7.47,18.44 10.59,18.44 11.96,19.81 12.27,19.81 ANALOG.1
  Bottom 0.305: 6.02,18.44 6.02,10.67 8.38,8.31 8.38,3.05 8.84,2.59 LIGHTDRIVE.1 | 6.02,18.44 6.02,25.45 I2C.1 | ANALOG.9 12.34,30.1 12.34,32.54 ANALOG.11 12.34,32.69 12.34,35.05 ANALOG.13 12.42,35.13 17.14,39.85 17.22,39.93 | ANALOG.1 12.34,19.89 12.34,22.4 ANALOG.3 | v16.92,42.52 16.92,40.23 17.22,39.93 | D2.C 17.22,39.93 | v7.47,18.44 6.1,18.44 6.02,18.44
XOUT_1
  Top 0.152: IC1.4 26.67,6.4 26.67,12.04 28.27,13.64 28.27,14.94 28.88,15.54 29.57,15.54 30.79,14.33 30.79,11.81 36.8,5.79 36.8,2.59 XOUT.1
XOUT_2
  Top 0.152: IC1.6 31.77,6.33 31.77,5.11 34.29,2.59 XOUT.2
XOUT_3
  Bottom 0.152: IC1.8 34.29,13.95 34.29,8.31 32.69,6.71 32.69,3.5 31.77,2.59 XOUT.3
XOUT_4
  Top 0.152: IC1.10 29.26,13.95 29.26,8.23 30.18,7.32 30.18,3.5 29.26,2.59 XOUT.4
XOUT_5
  Top 0.152: IC1.12 24.16,13.95 24.16,10.13 25.68,8.61 25.68,3.58 26.67,2.59 XOUT.5

### Text on the board
tNames: Vin | GND | N.O. | Com. | N.C. | Ichi KANAYA, Ph.D. | How to make | Founder, Pineapple Computer / Founder, TEDxSaikai / Professor, Univ. of Nagasaki / https://pineapple.cc/card / kanaya@pineapple.cc, @kanaya | Vcc | GND | D5 | D8 | D12 | SC | MO | NC | A6 | A5 | A4 | A3 | A2 | A1 | A0 | G | D3 | D5 | D6 | D9 | D10 | D11 | D13 | GND | 3V3
bNames: Pineapple IIc 1.2.0 | 4-M2 | MC1: Arduino Micro 5V / SW1: Comp. HEX / Con 5V: Pin 2p / Con Analog: ML 14p / Con DC: DC Jack / Con Digital: Pin 9p / Con GND: Pin 2x4p / Con Lightdrive: Pin 7p / Con I2C: SH 5p / Con MIDI: DIN 5p/PH 5p / Con Relay: PH 3p / Con RST: PH 2p / Con XOUT: Pin 5p / Pogo: Pin 1p | R1-3: 220 / R4-5: 10k / R6-7: 6.8k / RN1: 330 / RN2: 10k / C1: 0.1u / C2-3: 0.01u / K1: G5V-1 / D1-2: 1N4148 / LED1-8: If20m / T1: 2SC1815 / OK1: TLP552 / IC1: 74LS07 / IC2: PCA9517ADP | 91x55mm | 5 | IN | 4 | 5 | OUT | 3 | 4 | LIGHTDRIVE | ANALOG | DIGITAL